# Altium schematic sheet DMN62D0UW-71_DMN62D0UW-7.schdoc
size 127 x 99 mm
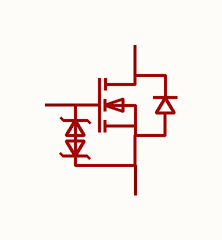
[diagram p0: DMN62D0UW-71_DMN62D0UW-7.schdoc]

## Parts
Q?  DMN62D0UW-7  [SOT-323-3_L2.2-W1.3-P1.30-LS2.1-BR]  (value not drawn)

## Nets

Not connected (* = marked no-connect by the designer): Q? 1(G) 2(S) 3(D)

## Library data of the parts
Q? = DMN62D0UW-7: Manufacturer: DIODES(美台); Add into BOM: yes; Type: 1个N沟道; Drain Source Voltage (Vdss): 60V; Continuous Drain Current (Id): 340mA; Power Dissipation (Pd): 320mW; Drain Source On Resistance (RDS(on)@Vgs,Id): 2Ω@100mA,4.5V; Gate Threshold Voltage (Vgs(th)@Id): 1V@250uA; Total Gate Charge (Qg@Vgs): 500pC@4.5V; Input Capacitance (Ciss@Vds): 32pF@30V; Symbol: DMN62D0UW-7; Device: DMN62D0UW-7; LCSC Part Name: 1个N沟道 耐压:60V 电流:340mA; Supplier Part: C151358; Manufacturer Part: DMN62D0UW-7; Supplier Footprint: SOT-323-3; JLCPCB Part Class: Extended Part; Datasheet: https://atta.szlcsc.com/upload/public/pdf/source/20210316/C151358_77A317229BAFCB79ABAE56FD0D7BC675.pdf; Supplier: LCSC; Convert to PCB: yes; Reverse Transfer Capacitance (Crss@Vds): -; Operating Temperature: -55℃~+150℃@(Tj)